# EasyEDA Pro project FMLightRC_Receiver.eprj

# Schematic Schematic1
Board Name: Board1; Create Date: 2024-10-04
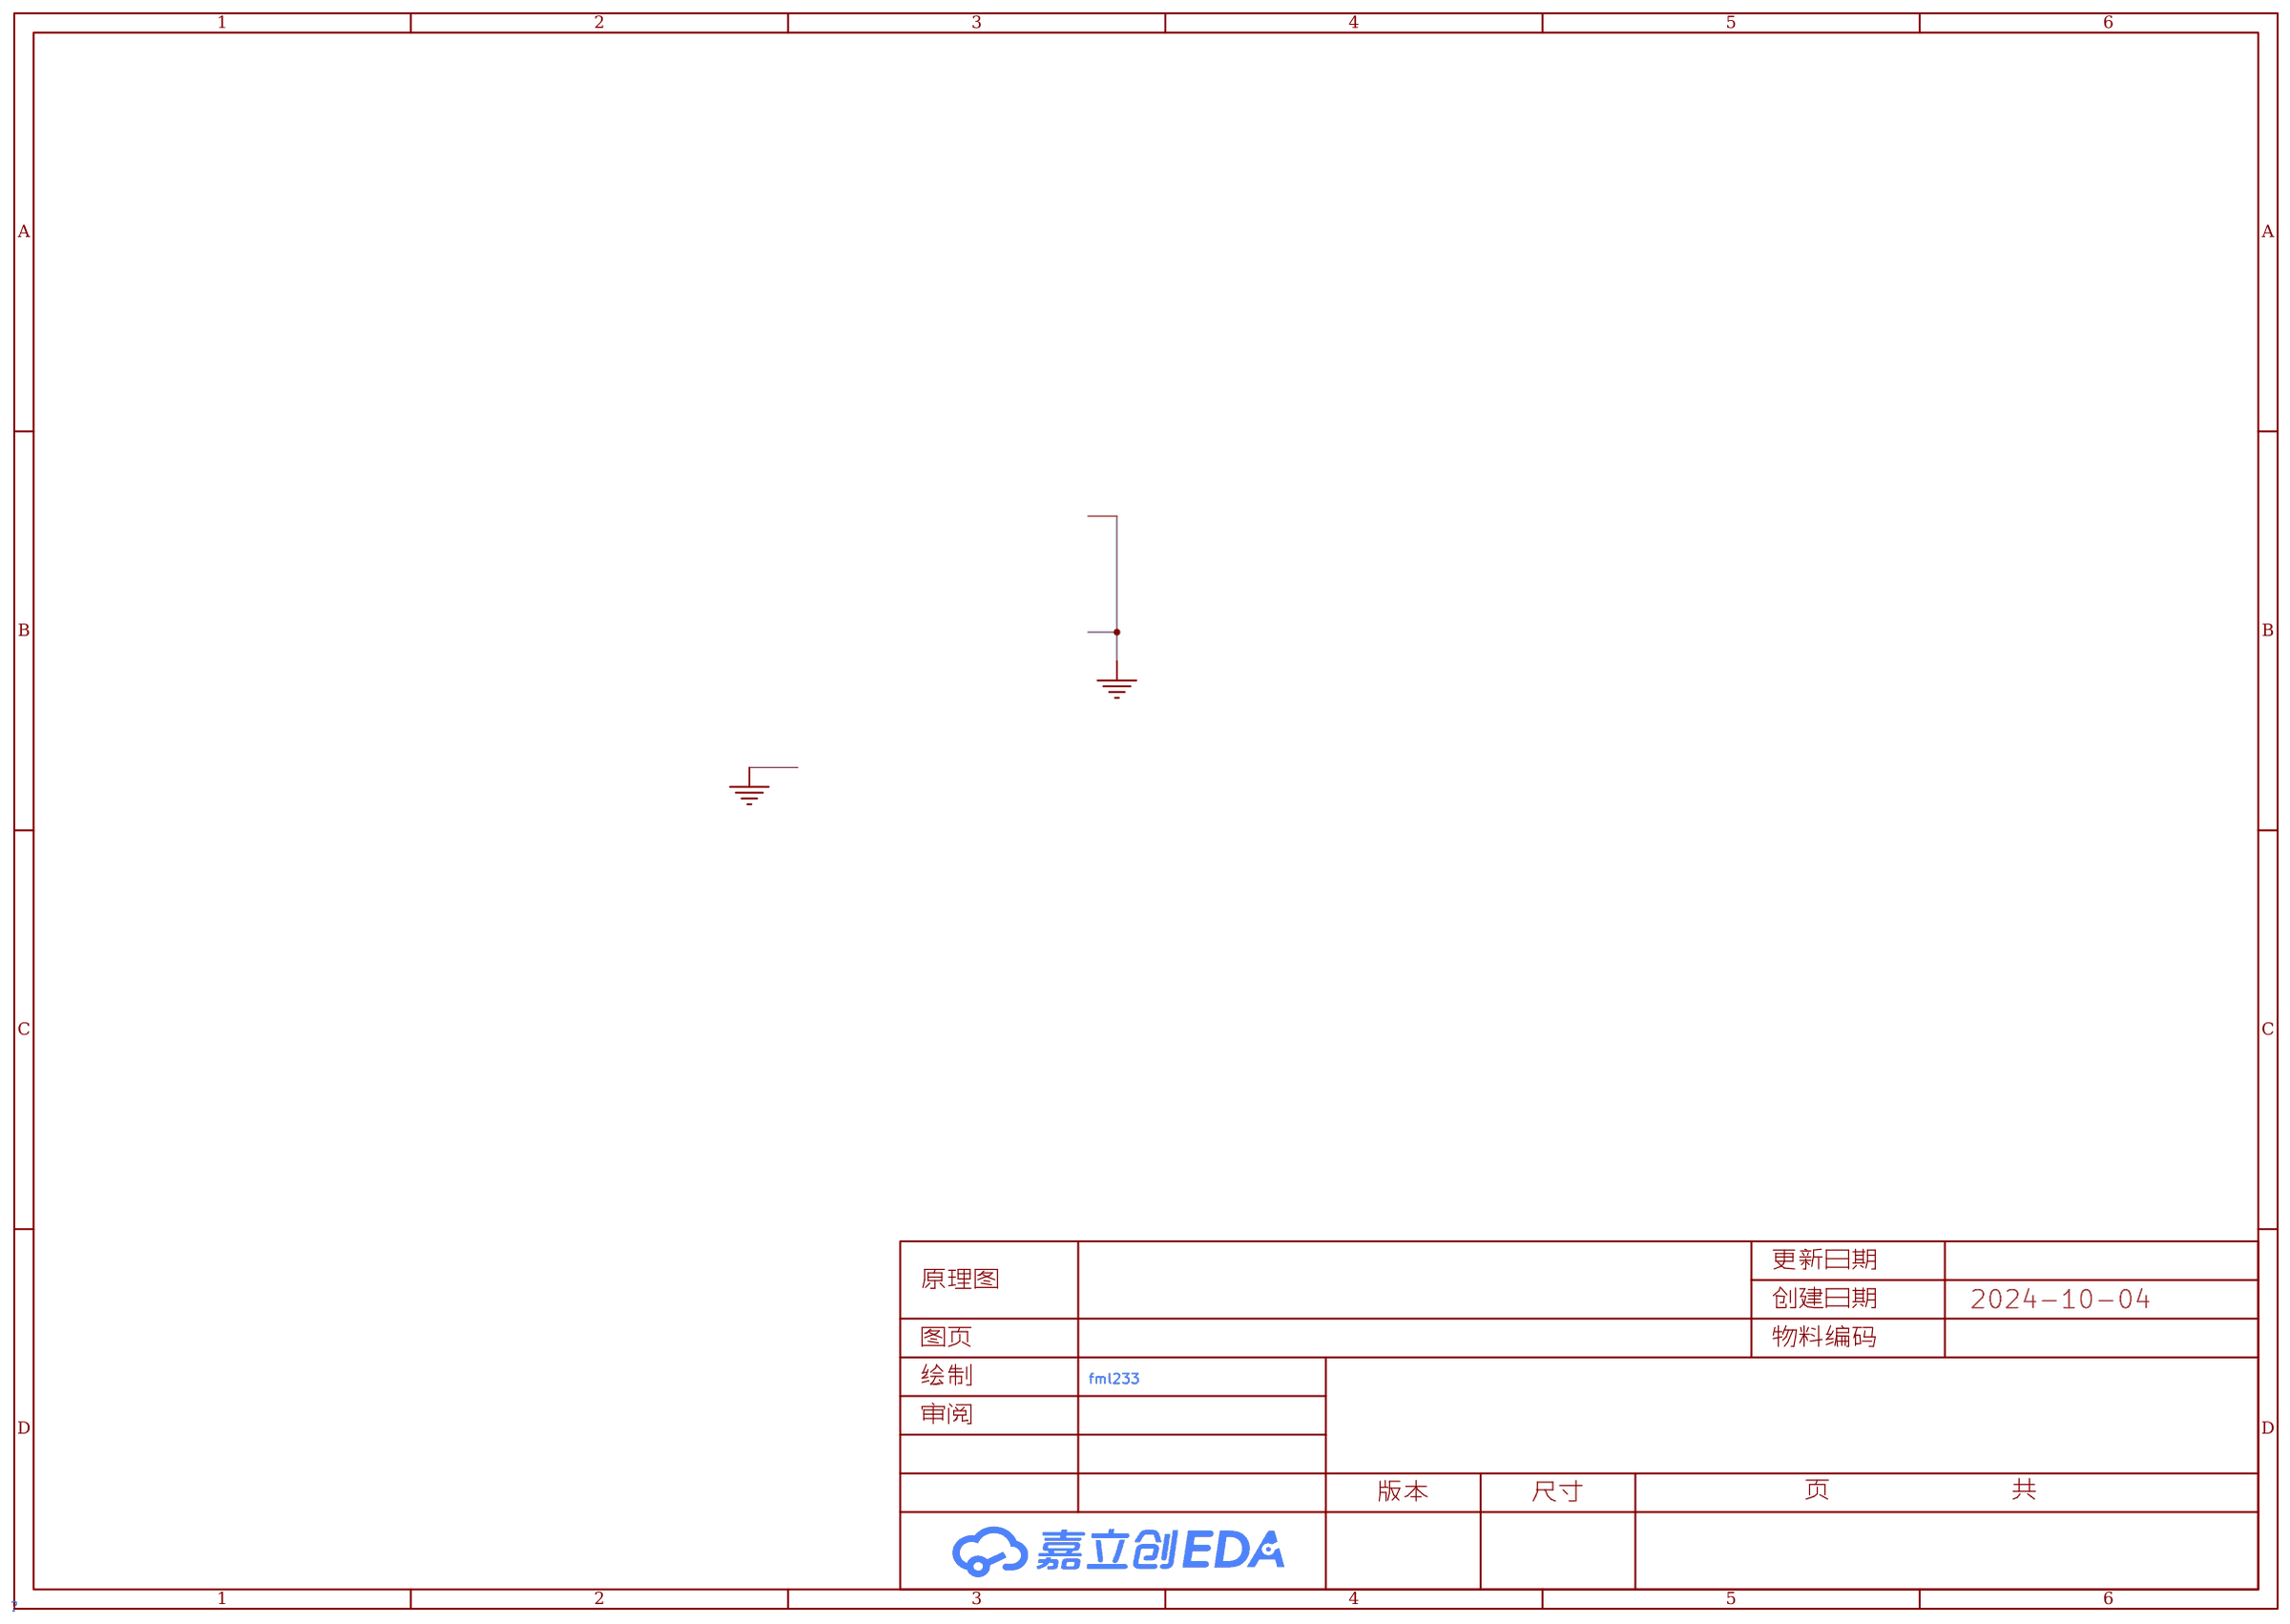
[diagram p0: schematic sheet]

## Parts
?#1  -

## Nets
GND: ?#1.14(GND0) ?#1.20(GND1) ?#1.26(GND2)

Not connected (* = marked no-connect by the designer): ?#1 1(3V3) 2(EN) 3(SVP) 4(SVN) 5(P34) 6(P35) 7(P32) 8(P33) 9(P25) 10(P26) 11(P27) 12(P14) 13(P12) 15(P13) 16(SD2) 17(SD3) 18(CMD) 19(5V) 21(P23) 22(P22) 23(TX) 24(RX) 25(P21) 27(P19) 28(P18) 29(P5) 30(P17) 31(P16) 32(P4) 33(P0) 34(P2) 35(P15) 36(SD1) 37(SD0) 38(CLK)

## Notes on the sheet
- fml233
